# Altium schematic sheet [3] TopLevel.SchDoc
size A3; DocumentNumber: 3; SheetNumber: 3; SheetTotal: 9
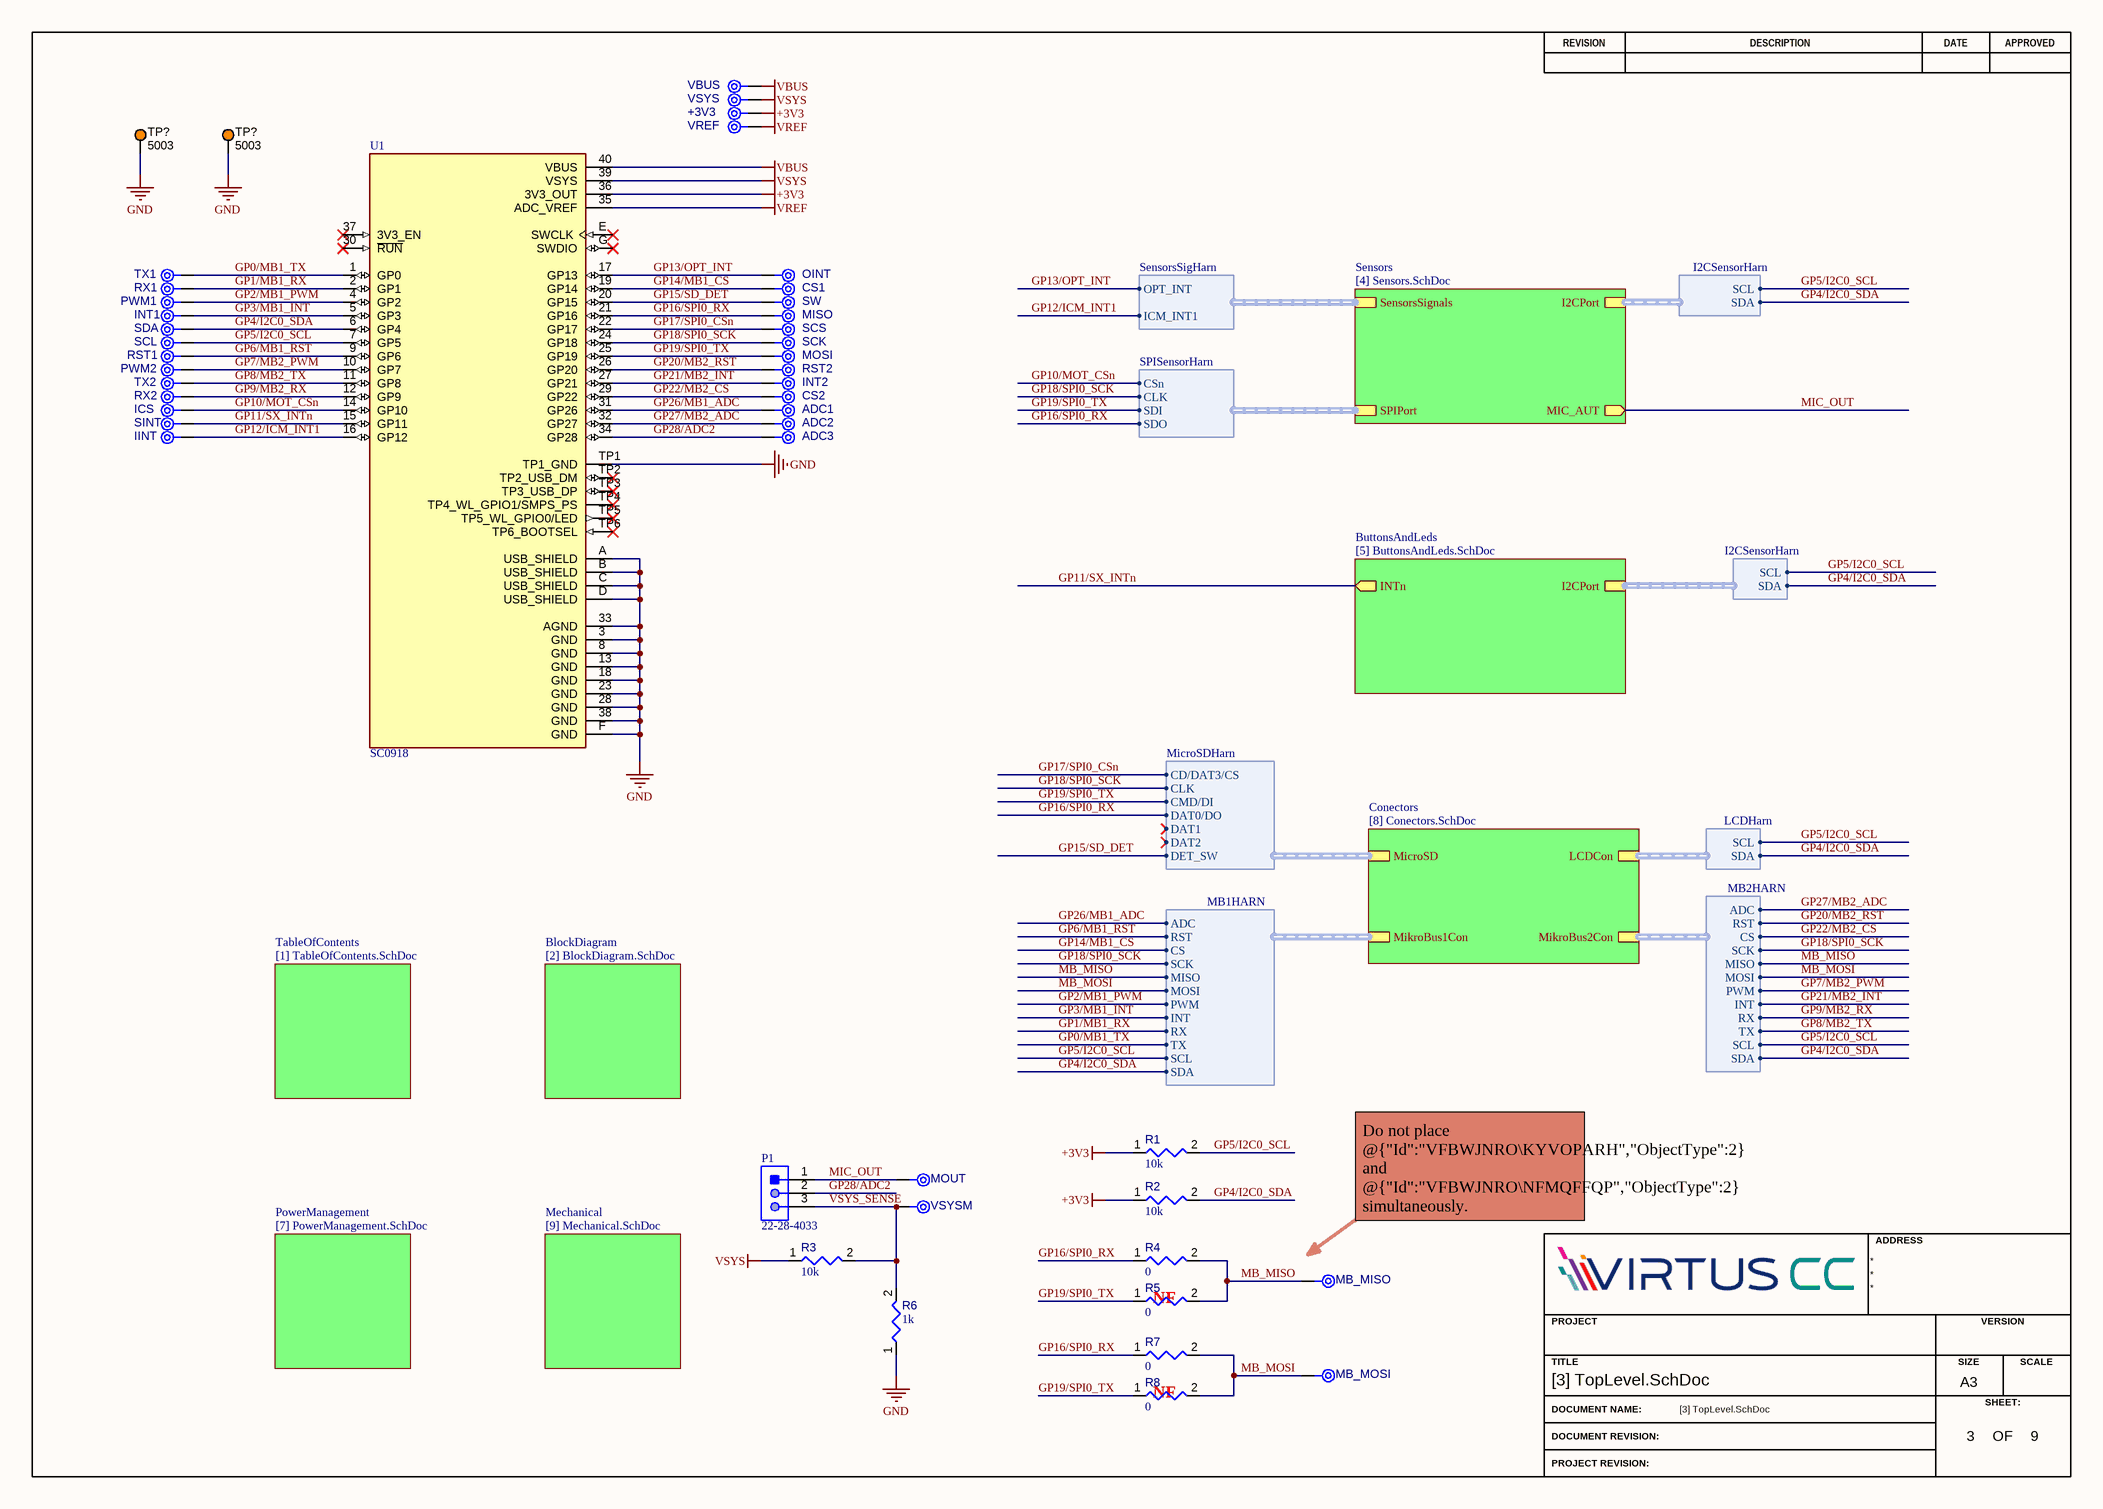
[diagram p0: [3] TopLevel.SchDoc]

## Parts
(Parts that share a designator on the sheet are numbered #1, #2 ... from top to bottom, then left to right.)
+3V3  TPAD6R  [TP06R]  (value not drawn)  (no BOM)
ADC1  TPAD6R  [TP06R]  (value not drawn)  (no BOM)
ADC2  TPAD6R  [TP06R]  (value not drawn)  (no BOM)
ADC3  TPAD6R  [TP06R]  (value not drawn)  (no BOM)
CS1  TPAD6R  [TP06R]  (value not drawn)  (no BOM)
CS2  TPAD6R  [TP06R]  (value not drawn)  (no BOM)
ICS  TPAD6R  [TP06R]  (value not drawn)  (no BOM)
IINT  TPAD6R  [TP06R]  (value not drawn)  (no BOM)
INT1  TPAD6R  [TP06R]  (value not drawn)  (no BOM)
INT2  TPAD6R  [TP06R]  (value not drawn)  (no BOM)
MB_MISO  TPAD6R  [TP06R]  (value not drawn)  (no BOM)
MB_MOSI  TPAD6R  [TP06R]  (value not drawn)  (no BOM)
MISO  TPAD6R  [TP06R]  (value not drawn)  (no BOM)
MOSI  TPAD6R  [TP06R]  (value not drawn)  (no BOM)
MOUT  TPAD6R  [TP06R]  (value not drawn)  (no BOM)
OINT  TPAD6R  [TP06R]  (value not drawn)  (no BOM)
P1  22-28-4033  [MOLX-22-28-4033_V]
PWM1  TPAD6R  [TP06R]  (value not drawn)  (no BOM)
PWM2  TPAD6R  [TP06R]  (value not drawn)  (no BOM)
R1  value 10k  [RESC0603(1608)_L]  (hidden comment: Resistor 10k +/-1% 0603 100 mW)
R2  value 10k  [RESC0603(1608)_L]  (hidden comment: Resistor 10k +/-1% 0603 100 mW)
R3  value 10k  [RESC0603(1608)_L]  (hidden comment: Resistor 10k +/-1% 0603 100 mW)
R4  value 0  [RESC0603(1608)_L]  (hidden comment: Resistor 0R +/- 5% 0603 100 mW)
R5  value 0  [RESC0603(1608)_L]  (hidden comment: Resistor 0R +/- 5% 0603 100 mW)
R6  value 1k  [RESC0603(1608)_L]  (hidden comment: Resistor 1k +/-1% 0603 100 mW)
R7  value 0  [RESC0603(1608)_L]  (hidden comment: Resistor 0R +/- 5% 0603 100 mW)
R8  value 0  [RESC0603(1608)_L]  (hidden comment: Resistor 0R +/- 5% 0603 100 mW)
RST1  TPAD6R  [TP06R]  (value not drawn)  (no BOM)
RST2  TPAD6R  [TP06R]  (value not drawn)  (no BOM)
RX1  TPAD6R  [TP06R]  (value not drawn)  (no BOM)
RX2  TPAD6R  [TP06R]  (value not drawn)  (no BOM)
SCK  TPAD6R  [TP06R]  (value not drawn)  (no BOM)
SCL  TPAD6R  [TP06R]  (value not drawn)  (no BOM)
SCS  TPAD6R  [TP06R]  (value not drawn)  (no BOM)
SDA  TPAD6R  [TP06R]  (value not drawn)  (no BOM)
SINT  TPAD6R  [TP06R]  (value not drawn)  (no BOM)
SW  TPAD6R  [TP06R]  (value not drawn)  (no BOM)
TP?#1  5003  [KSTN-5003]
TP?#2  5003  [KSTN-5003]
TX1  TPAD6R  [TP06R]  (value not drawn)  (no BOM)
TX2  TPAD6R  [TP06R]  (value not drawn)  (no BOM)
U1  SC0918  [MODULE_SC0918]
VBUS  TPAD6R  [TP06R]  (value not drawn)  (no BOM)
VREF  TPAD6R  [TP06R]  (value not drawn)  (no BOM)
VSYS  TPAD6R  [TP06R]  (value not drawn)  (no BOM)
VSYSM  TPAD6R  [TP06R]  (value not drawn)  (no BOM)

## Sub-sheets
BlockDiagram = [2] BlockDiagram.SchDoc: no entries
ButtonsAndLeds = [5] ButtonsAndLeds.SchDoc: INTn (out), I2CPort (harness I2CSensorHarn)
Conectors = [8] Conectors.SchDoc: MikroBus2Con (harness MB2HARN), MikroBus1Con (harness MB1HARN), MicroSD (harness MicroSDHarn), LCDCon (harness LCDHarn)
Mechanical = [9] Mechanical.SchDoc: no entries
PowerManagement = [7] PowerManagement.SchDoc: no entries
Sensors = [4] Sensors.SchDoc: SPIPort (harness SPISensorHarn), SensorsSignals (harness SensorsSigHarn), I2CPort (harness I2CSensorHarn), MIC_AUT (out)
TableOfContents = [1] TableOfContents.SchDoc: no entries

## Harnesses
I2CSensorHarn: SCL, SDA
SensorsSigHarn: OPT_INT, ICM_INT1
SPISensorHarn: CSn, CLK, SDI, SDO
LCDHarn: SCL, SDA
MB2HARN: ADC, RST, CS, SCK, MISO, MOSI, PWM, INT, RX, TX, SCL, SDA
MB1HARN: ADC, RST, CS, SCK, MISO, MOSI, PWM, INT, RX, TX, SCL, SDA
MicroSDHarn: CLK, CMD/DI, DAT0/DO, DAT1, DAT2, CD/DAT3/CS, DET_SW

## Nets
+3V3: +3V3.1(TP) R1.1 R2.1 U1.36(3V3_OUT)
GND: R6.1 TP?#1.1 TP?#2.1 U1.3(GND) U1.8(GND) U1.13(GND) U1.18(GND) U1.23(GND) U1.28(GND) U1.33(AGND) U1.38(GND) U1.A(USB_SHIELD) U1.B(USB_SHIELD) U1.C(USB_SHIELD) U1.D(USB_SHIELD) U1.F(GND) U1.TP1(TP1_GND)
VBUS: U1.40(VBUS) VBUS.1(TP)
VREF: U1.35(ADC_VREF) VREF.1(TP)
VSYS: R3.1 U1.39(VSYS) VSYS.1(TP)
GP0/MB1_TX: TX1.1(TP) U1.1(GP0) ; sheet Conectors/MikroBus1Con.TX
GP1/MB1_RX: RX1.1(TP) U1.2(GP1) ; sheet Conectors/MikroBus1Con.RX
GP2/MB1_PWM: PWM1.1(TP) U1.4(GP2) ; sheet Conectors/MikroBus1Con.PWM
GP3/MB1_INT: INT1.1(TP) U1.5(GP3) ; sheet Conectors/MikroBus1Con.INT
GP4/I2C0_SDA: R2.2 SDA.1(TP) U1.6(GP4) ; sheet Sensors/I2CPort.SDA, sheet Conectors/LCDCon.SDA, sheet Conectors/MikroBus2Con.SDA, sheet Conectors/MikroBus1Con.SDA, sheet ButtonsAndLeds/I2CPort.SDA
GP5/I2C0_SCL: R1.2 SCL.1(TP) U1.7(GP5) ; sheet Sensors/I2CPort.SCL, sheet Conectors/LCDCon.SCL, sheet Conectors/MikroBus2Con.SCL, sheet Conectors/MikroBus1Con.SCL, sheet ButtonsAndLeds/I2CPort.SCL
GP6/MB1_RST: RST1.1(TP) U1.9(GP6) ; sheet Conectors/MikroBus1Con.RST
GP7/MB2_PWM: PWM2.1(TP) U1.10(GP7) ; sheet Conectors/MikroBus2Con.PWM
GP8/MB2_TX: TX2.1(TP) U1.11(GP8) ; sheet Conectors/MikroBus2Con.TX
GP9/MB2_RX: RX2.1(TP) U1.12(GP9) ; sheet Conectors/MikroBus2Con.RX
GP10/MOT_CSn: ICS.1(TP) U1.14(GP10) ; sheet Sensors/SPIPort.CSn
GP11/SX_INTn: SINT.1(TP) U1.15(GP11) ; sheet ButtonsAndLeds/INTn
GP12/ICM_INT1: IINT.1(TP) U1.16(GP12) ; sheet Sensors/SensorsSignals.ICM_INT1
GP13/OPT_INT: OINT.1(TP) U1.17(GP13) ; sheet Sensors/SensorsSignals.OPT_INT
GP14/MB1_CS: CS1.1(TP) U1.19(GP14) ; sheet Conectors/MikroBus1Con.CS
GP15/SD_DET: SW.1(TP) U1.20(GP15) ; sheet Conectors/MicroSD.DET_SW
GP16/SPI0_RX: MISO.1(TP) R4.1 R7.1 U1.21(GP16) ; sheet Sensors/SPIPort.SDO, sheet Conectors/MicroSD.DAT0/DO
GP17/SPI0_CSn: SCS.1(TP) U1.22(GP17) ; sheet Conectors/MicroSD.CD/DAT3/CS
GP18/SPI0_SCK: SCK.1(TP) U1.24(GP18) ; sheet Sensors/SPIPort.CLK, sheet Conectors/MikroBus2Con.SCK, sheet Conectors/MikroBus1Con.SCK, sheet Conectors/MicroSD.CLK
GP19/SPI0_TX: MOSI.1(TP) R5.1 R8.1 U1.25(GP19) ; sheet Sensors/SPIPort.SDI, sheet Conectors/MicroSD.CMD/DI
GP20/MB2_RST: RST2.1(TP) U1.26(GP20) ; sheet Conectors/MikroBus2Con.RST
GP21/MB2_INT: INT2.1(TP) U1.27(GP21) ; sheet Conectors/MikroBus2Con.INT
GP22/MB2_CS: CS2.1(TP) U1.29(GP22) ; sheet Conectors/MikroBus2Con.CS
GP26/MB1_ADC: ADC1.1(TP) U1.31(GP26) ; sheet Conectors/MikroBus1Con.ADC
GP27/MB2_ADC: ADC2.1(TP) U1.32(GP27) ; sheet Conectors/MikroBus2Con.ADC
GP28/ADC2: ADC3.1(TP) P1.2 U1.34(GP28)
MB_MISO: MB_MISO.1(TP) R4.2 R5.2 ; sheet Conectors/MikroBus2Con.MISO, sheet Conectors/MikroBus1Con.MISO
MB_MOSI: MB_MOSI.1(TP) R7.2 R8.2 ; sheet Conectors/MikroBus2Con.MOSI, sheet Conectors/MikroBus1Con.MOSI
MIC_OUT: MOUT.1(TP) P1.1 ; sheet Sensors/MIC_AUT
VSYS_SENSE: P1.3 R3.2 R6.2 VSYSM.1(TP)

Not connected (* = marked no-connect by the designer): U1 30(~{RUN})* 37(3V3_EN)* E(SWCLK)* G(SWDIO)* TP2(TP2_USB_DM)* TP3(TP3_USB_DP)* TP4(TP4_WL_GPIO1/SMPS_PS)* TP5(TP5_WL_GPIO0/LED)* TP6(TP6_BOOTSEL)*

## Notes on the sheet
- Do not place @{"Id":"VFBWJNRO\KYVOPARH","ObjectType":2} and @{"Id":"VFBWJNRO\NFMQFFQP","ObjectType":2} simultaneously.
  Do not place @{"Id":"VFBWJNRO\IKILTTYE","ObjectType":2} and @{"Id":"VFBWJNRO\AIELESCA","ObjectType":2} simultaneously
- (near R5) NF
- (near R8) NF
- REVISION
- DESCRIPTION
- DATE
- APPROVED
- ADDRESS
- PROJECT
- VERSION
- TITLE
- A3
- SIZE
- SCALE
- DOCUMENT NAME:
- DOCUMENT REVISION:
- OF
- SHEET:
- PROJECT REVISION:

## Library data of the parts
+3V3 ADC1-ADC3 CS1 CS2 ICS IINT INT1 INT2 MB_MISO MB_MOSI MISO MOSI MOUT OINT PWM1 PWM2 RST1 RST2 RX1 RX2 SCK SCL SCS SDA SINT SW TX1 TX2 VBUS VREF VSYS VSYSM = CMP-00028-00002-2: 0.6mm round; Pins: 1; Component Type: Mechanical
P1 = CMP-002-00076-1: KK 254 Breakaway Header Vertical 3 Circuits 0.38um Gold Selective Plating Mating Pin 6.09mm; Pitch: 2.54mm; Number of Positions: 3; Contact Resistance: 20mR; Max Voltage Rating (AC): 250V; Current Rating: 4A; Gender: Male; Glow Wire Compliant: Non-compliant; RoHS Compliant: Yes; Contact Plating: Gold; Housing Color: Black; Housing Material: Nylon; Contact Mating Length: 0.24inch; Depth: 2.49mm; Number of Circuits: 3; Reach SVHC Compliant: Unknown; Packaging: Bulk; Max Voltage Rating (DC): 250V; Number of Rows: 1; Color: Black; Package Quantity: 1; Orientation: Straight; Number of Contacts: 3; Max Operating Temperature: 75°C; Mounting Technology: Through Hole; Min Operating Temperature: 0°C; Termination: Solder; Radiation Hardening: No; Series: KK® 42375; Contact Material: Brass,Bronze; Flammability Rating: UL94 V-0; Lead Free: Lead Free; Contact Type: Male Pin; Voltage Rating: 250V; Voltage Rating (DC): 250V
R1-R3 = CMP-009-00017-7: Chip Resistor, 10 KOhm, +/- 1%, 01 W, -55 to 155 degC, 0603 (1608 Metric); Power: 100mW; Voltage Rating: 50V; Mounting Technology: SM; Max Operating Temperature: 155°C; Case/Package: 0603; Tolerance: 1%; RoHS Compliant: True; Pins: 2; Min Operating Temperature: -55°C
R4 R5 R7 R8 = CMP-009-00006-6: Chip Resistor, 0 Ohm, 0.1 W, -55 to 155 degC, 0603 (1608 Metric); Power: 100mW; Voltage Rating: 50V; Tolerance: 5%; Mounting Technology: SM; RoHS Compliant: True; Max Operating Temperature: 155°C; Min Operating Temperature: -55°C; Case/Package: 0603; Pins: 2
R6 = CMP-009-00014-6: Chip Resistor, 1 KOhm, +/-1%, 0.1 W, -55 to 155 degC, 0603 (1608 Metric); Power: 100mW; Tolerance: 1%; Voltage Rating: 50V; Mounting Technology: SM; Case/Package: 0603; Min Operating Temperature: -55°C; RoHS Compliant: True; Max Operating Temperature: 155°C; Pins: 2
TP?#1 TP?#2 = CMP-002-00037-2: Test Point, Orange, Height 4.6 mm, Tail Length 3 mm, 1-Pin THD, RoHS; Manufacturer: Keystone; Colour: Orange; Packaging: Bulk; Package Description: 1-Pin Through Hole Device, Dia 2.54 mm; Pins: 1; Package Reference: 5003; Datasheet Version: Jun-15; Case/Package: 5003; Mounting Technology: TH; Connector Type: TestPoint; Diameter: 2.54mm; Contact Material: Bronze; Datasheet URL: http://keyelco.com/userAssets/file/M65p56.pdf; Manufacturer URL: http://www.keyelco.com/; Package Quantity: 10; Contact Plating: Tin; RoHS Compliant: True
U1 = CMP-006-000001-6: Raspberry Pi Pico W RP2040; Check_prices: https://www.snapeda.com/parts/SC0918/Raspberry+Pi/view-part/?ref=eda; MF: Raspberry Pi; Design Item ID: SC0918; SnapEDA_Link: https://www.snapeda.com/parts/SC0918/Raspberry+Pi/view-part/?ref=snap; Pin Count: 53; Value: *; Purchase-URL: https://pricing.snapeda.com/search/part/SC0918/?ref=eda; MP: SC0918; Source: SC0918.SchLib; Package: None; Availability: In Stock; Price: None; Component Type: Standard